# Altium schematic sheet USB_FTDI.SchDoc
size Letter
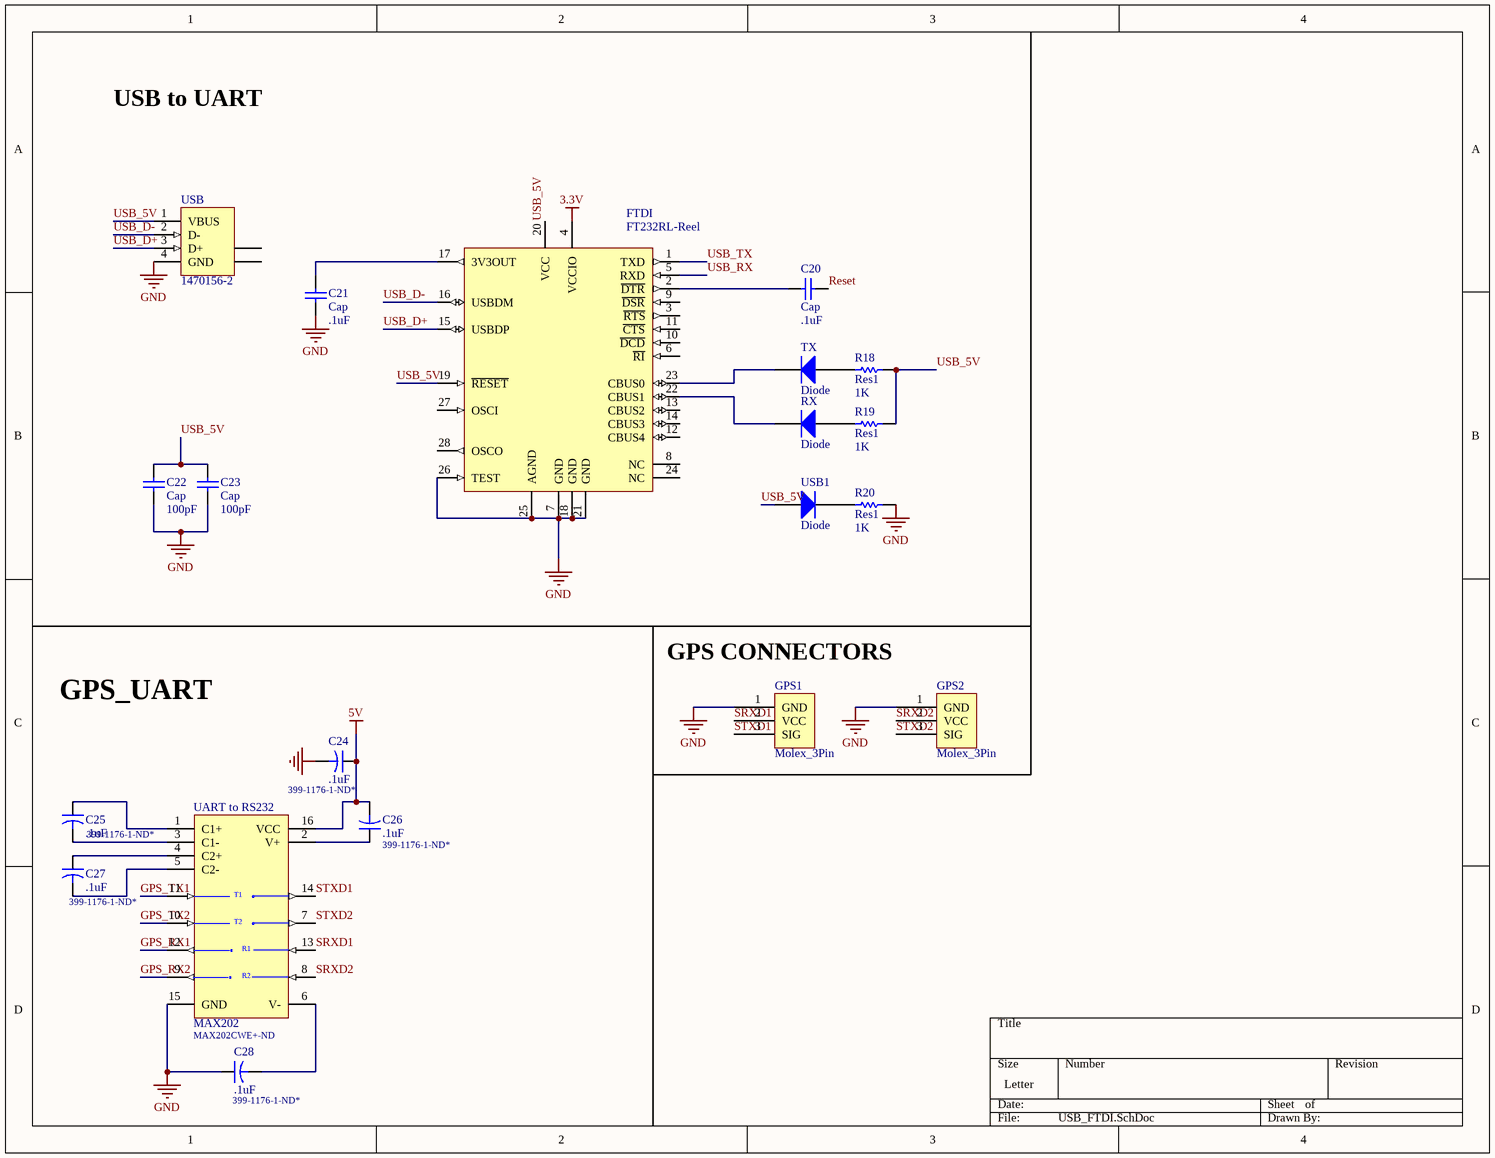
[diagram p0: USB_FTDI.SchDoc]

## Parts
C20  Cap  value .1uF  [1608[0603]]
C21  Cap  value .1uF  [1608[0603]]
C22  Cap  value 100pF  [1608[0603]]
C23  Cap  value 100pF  [1608[0603]]
C24  .1uF  [1608[0603]]
C25  .1uF  [1608[0603]]
C26  .1uF  [1608[0603]]
C27  .1uF  [1608[0603]]
C28  .1uF  [1608[0603]]
FTDI  FT232RL-Reel  [SSOP-28_N]
GPS1  Molex_3Pin  [PCBComponent_1]
GPS2  Molex_3Pin  [PCBComponent_1]
R18  Res1  value 1K  [1608[0603]]
R19  Res1  value 1K  [1608[0603]]
R20  Res1  value 1K  [1608[0603]]
RX  Diode  [1608[0603]]
TX  Diode  [1608[0603]]
UART_to_RS232  MAX202  [WSO16_N]
USB  1470156-2  [1470156]
USB1  Diode  [1608[0603]]

## Nets
3.3V: FTDI.4(VCCIO)
5V: C24.1 C26.2 UART_to_RS232.16(VCC)
GND: C21.1 C22.1 C23.1 C24.2 C28.1 FTDI.7(GND) FTDI.18(GND) FTDI.21(GND) FTDI.25(AGND) FTDI.26(TEST) GPS1.1(GND) GPS2.1(GND) R20.2 UART_to_RS232.15(GND) USB.4(GND)
GPS_RX1: UART_to_RS232.12(R1OUT)
GPS_RX2: UART_to_RS232.9(R2OUT)
GPS_TX1: UART_to_RS232.11(T1IN)
GPS_TX2: UART_to_RS232.10(T2IN)
Reset: C20.1
SRXD1: GPS1.2(VCC) UART_to_RS232.13(R1IN)
SRXD2: GPS2.2(VCC) UART_to_RS232.8(R2IN)
STXD1: GPS1.3(SIG) UART_to_RS232.14(T1OUT)
STXD2: GPS2.3(SIG) UART_to_RS232.7(T2OUT)
USB_5V: C22.2 C23.2 FTDI.19(~{RESET}) FTDI.20(VCC) R18.2 R19.2 USB.1(VBUS) USB1.1(A)
USB_D+: FTDI.15(USBDP) USB.3(D+)
USB_D-: FTDI.16(USBDM) USB.2(D-)
USB_RX: FTDI.5(RXD)
USB_TX: FTDI.1(TXD)
NetC20_2: C20.2 FTDI.2(~{DTR})
NetC21_2: C21.2 FTDI.17(3V3OUT)
NetC25_1: C25.1 UART_to_RS232.1(C1+)
NetC25_2: C25.2 UART_to_RS232.3(C1-)
NetC26_1: C26.1 UART_to_RS232.2(V+)
NetC27_1: C27.1 UART_to_RS232.4(C2+)
NetC27_2: C27.2 UART_to_RS232.5(C2-)
NetC28_2: C28.2 UART_to_RS232.6(V-)
NetFTDI_22: FTDI.22(CBUS1) RX.2(K)
NetFTDI_23: FTDI.23(CBUS0) TX.2(K)
NetR18_1: R18.1 TX.1(A)
NetR19_1: R19.1 RX.1(A)
NetR20_1: R20.1 USB1.2(K)

Not connected (* = marked no-connect by the designer): FTDI 3(~{RTS}) 6(~{RI}) 8(NC) 9(~{DSR}) 10(~{DCD}) 11(~{CTS}) 12(CBUS4) 13(CBUS2) 14(CBUS3) 24(NC) 27(OSCI) 28(OSCO); USB 5(SHLD) 6(SHLD)

## Notes on the sheet
- USB to UART
- GPS_UART
- (near GPS1) GPS CONNECTORS
- (near C25) 399-1176-1-ND*
- 399-1176-1-ND*
- (near C27) 399-1176-1-ND*
- (near C26) 399-1176-1-ND*
- MAX202CWE+-ND
- (near C28) 399-1176-1-ND*
- (in symbol MAX202CWE) T1; T2; R1; R2

## Library data of the parts
C20-C23 = Cap: Capacitor; Published: 8-Jun-2000; LatestRevisionDate: 17-Jul-2002; LatestRevisionNote: Re-released for DXP Platform.; PackageReference: RAD-0.3; Publisher: Altium Limited; PackageDescription: Radial Cap, Thru-Hole; 2 Leads; 0.3 in Pin Spacing
C24-C28 = 0805 Cap
FTDI = FT232RL-Reel: USB UART Asynchronous Serial Data Transfer Chip, SSOP-28, Tape and Reel; Published: 19-Aug-2010; DatasheetVersion: ver 2.07, Jul-2010; PackageVersion: 2010; PackageReference: SSOP-28; Publisher: Altium Limited; PackageDescription: 28-Pin Small Outline Package 0.65 mm Pitch; ComponentLink1Description: Manufacturer Link; ComponentLink1URL: http://www.ftdichip.com/Products/ICs/FT232R.htm; ComponentLink2Description: Datasheet; ComponentLink2URL: http://www.ftdichip.com/Support/Documents/DataSheets/ICs/DS_FT232R.pdf
R18-R20 = Res1: Resistor; Published: 8-Jun-2000; LatestRevisionDate: 17-Jul-2002; LatestRevisionNote: Re-released for DXP Platform.; PackageReference: AXIAL-0.3; Publisher: Altium Limited; PackageDescription: Axial Device, Thru-Hole; 2 Leads; 0.3 in Pin Spacing
RX TX USB1 = Diode: Default Diode; Published: 8-Jun-2000; LatestRevisionDate: 17-Jul-2002; LatestRevisionNote: Re-released for DXP Platform.; PackageVersion: Sep-1996; PackageReference: SMC; Publisher: Altium Limited; PackageDescription: DO-214-AB/SMC; 2 C-Bend Leads; Body 7.9 x 5.9 mm, inc. leads (LxW); Code_JEDEC: DO-214-AB
UART_to_RS232 = MAX202CWE: +5V RS-232 Transceiver with 0.1µF External Capacitor (Digi-Key#: MAX202CWE+-ND); Published: 16-Jan-2001; LatestRevisionDate: 13-Apr-2006; LatestRevisionNote: IPC-7351 Footprint Added.; DatasheetVersion: Dec-1996; PackageReference: WSO16; Publisher: Altium Limited; PackageDescription: 16-Pin Small Outline Integrated Circuit 1.27 mm Pitch; Code_JEDEC: MS-013-AA; Code_IPC: SOIC127P1030-16; ComponentLink1Description: Manufacturer Link; ComponentLink1URL: http://www.maxim-ic.com/; ComponentLink2Description: Datasheet; ComponentLink2URL: http://pdfserv.maxim-ic.com/en/ds/MAX200-MAX213.pdf
USB = 1470156-2: USB 1.1, Right Angle, Thru-Hole, B Type, Receptacle, 4 Position, Black; ContactMaterial: Phosphor Bronze; ContactPlating: Gold over Nickel; TerminationLength: 3.00mm [0.118in.]; PCB_Layout: Complies with manufacturer's recommendation.; DrillSize: Corresponds to nominal value.; PanelGround: Without; Published: 15-Jul-2004; DatasheetDocument: 02-Jun-2001; PackageDocument: 02-Jun-2001; PackageReference: 1470156; Publisher: Altium Limited; HousingMaterial: Glass-Filled Thermoplastic; ComponentLink1Description: Manufacturer Link; ComponentLink1URL: http://www.tycoelectronics.com/; ComponentLink2Description: Packaging Specification; ComponentLink2URL: http://ecommas.tycoelectronics.com/commerce/DocumentDelivery/DDEController?Action=showdoc&DocId=Customer+Drawing%7F1470156%7FO%7Ftif%7FEnglish%7FC_1470156_O.tif